# EAGLE design picoDotstar (EAGLE 9.6.2)
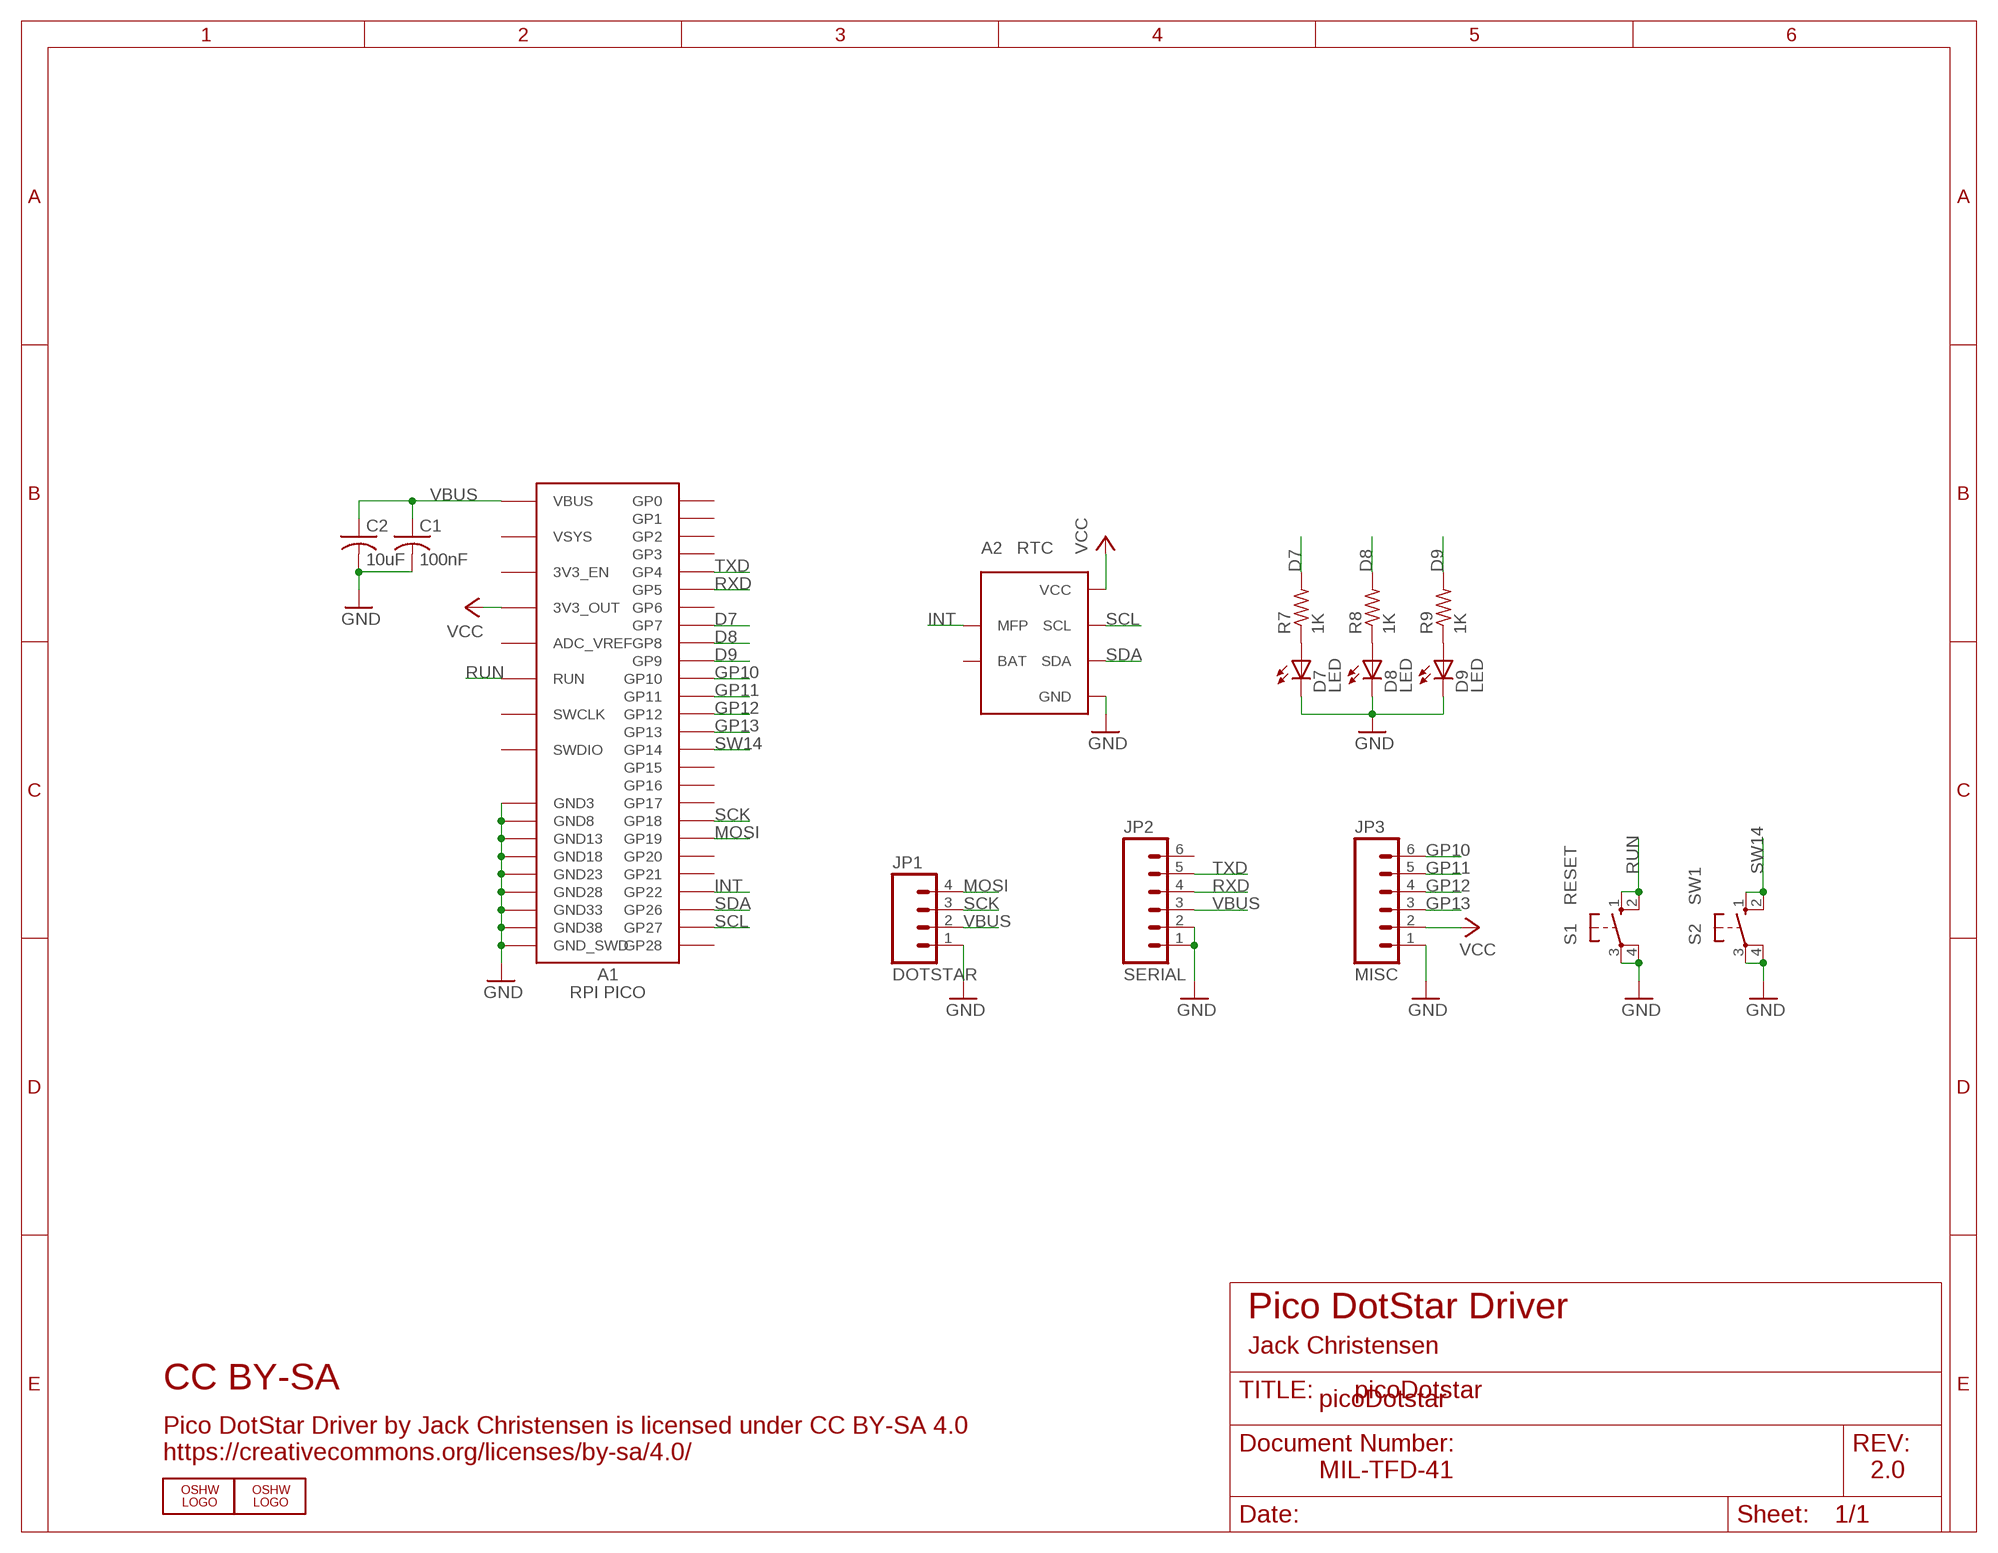
[diagram p0: schematic, sheet 1]

## Parts
A1  RPI PICO  PICOPICO  [PICO]
A2  RTC  RTC79412  [RTC79412]
C1  100nF  C-USM0805  [M0805]
C2  10uF  C-USM0805  [M0805]
D7  LED  LEDD0805  [D0805]
D8  LED  LEDD0805  [D0805]
D9  LED  LEDD0805  [D0805]
JP1  DOTSTAR  M04LOCK  [1X04_LOCK]
JP2  SERIAL  M06LOCK  [1X06_LOCK]
JP3  MISC  M06LOCK  [1X06_LOCK]
LOGO2  OSHW_LOGO_8MILX0100-NT  [OSHW_8X100_NOTEXT]
LOGO3  OSHW_LOGO_8MILX0150-NT  [OSHW_8X150_NOTEXT]
R7  1K  R-US_M0805  [M0805]
R8  1K  R-US_M0805  [M0805]
R9  1K  R-US_M0805  [M0805]
S1  RESET  10-XXOCT  [B3F-10XXOCT]
S2  SW1  10-XXOCT  [B3F-10XXOCT]

## Nets
D7: A1.P$10(GP7) R7.2
D8: A1.P$11(GP8) R8.2
D9: A1.P$12(GP9) R9.2
GND: A1.P$03(GND3) A1.P$08(GND8) A1.P$13(GND13) A1.P$18(GND18) A1.P$23(GND23) A1.P$28(GND28) A1.P$33(GND33) A1.P$38(GND38) A1.P$SWGND(GND_SWD) A2.8(GND) C1.2 C2.2 D7.K(C) D8.K(C) D9.K(C) JP1.1 JP2.1 JP2.2 JP3.1 S1.3(P) S1.4(P1) S2.3(P) S2.4(P1)
GP10: A1.P$14(GP10) JP3.6
GP11: A1.P$15(GP11) JP3.5
GP12: A1.P$16(GP12) JP3.4
GP13: A1.P$17(GP13) JP3.3
INT: A1.P$29(GP22) A2.3(MFP)
MOSI: A1.P$25(GP19) JP1.4
N$3: D7.A R7.1
N$4: D8.A R8.1
N$5: D9.A R9.1
RUN: A1.P$30(RUN) S1.1(S) S1.2(S1)
RXD: A1.P$07(GP5) JP2.4
SCK: A1.P$24(GP18) JP1.3
SCL: A1.P$32(GP27) A2.6(SCL)
SDA: A1.P$31(GP26) A2.5(SDA)
SW14: A1.P$19(GP14) S2.1(S) S2.2(S1)
TXD: A1.P$06(GP4) JP2.5
VBUS: A1.P$40(VBUS) C1.1 C2.1 JP1.2 JP2.3
VCC: A1.P$36(3V3_OUT) A2.7(VCC) JP3.2
Unconnected: A1.P$01(GP0) A1.P$02(GP1) A1.P$04(GP2) A1.P$05(GP3) A1.P$09(GP6) A1.P$20(GP15) A1.P$21(GP16) A1.P$22(GP17) A1.P$26(GP20) A1.P$27(GP21) A1.P$34(GP28) A1.P$35(ADC_VREF) A1.P$37(3V3_EN) A1.P$39(VSYS) A1.P$SWCLK(SWCLK) A1.P$SWDIO(SWDIO) A2.1(BAT) JP2.6

## Notes on the sheet
- Pico DotStar Driver
- Jack Christensen
- CC BY-SA
- picoDotstar
- Pico DotStar Driver by Jack Christensen is licensed under CC BY-SA 4.0
  https://creativecommons.org/licenses/by-sa/4.0/
- MIL-TFD-41 | 2.0

## Library data of the parts
A1 = _jc:PICO: Raspberry Pi Pico microcontroller.
A2 = _jc:RTC79412
C1 C2 = _jc:C-US: CAPACITOR, American symbol
D7-D9 = _jc:LED: LED OSRAM: - CHIPLED LG R971, LG N971, LY N971, LG Q971, LY Q971, LO R971, LY R971 LH N974, LH R974 LS Q976, LO Q976, LY Q976 LO Q996 - Hyper CHIPLED LW Q18S LB Q993, LB Q99A, LB R99A - SideLED LS A670, LO A670, LY A670, LG A670, LP A670 LB A673, LV A673, LT A673, LW A673 LH A674 LY A675 LS A676, LA A676, LO A676, LY A676, LW A676 LS A679, LY A679, LG A679 - Hyper Micro SIDELED® LS Y876, LA Y876, LO Y876, LY Y876 LT Y87S - SmartLED LW L88C, LW L88S LB L89C, LB L89S, LG L890 LS L89K, LO L89K, LY L89K LS L896, LA L896, LO L896, LY L896 - TOPLED LS T670, LO T670, LY T670, LG T670, LP T670 LSG T670, LSP T670, LSY T670, LOP T670, LYG T670 LG T671, LOG T671, LSG T671 LB T673, LV T673, LT T673, LW T673 LH T674 LS T676, LA T676, LO T676, LY T676, LB T676, LH T676, LSB T676, LW T676 LB T67C, LV T67C, LT T67C, LS T67K, LO T67K, LY T67K, LW E67C LS E67B, LA E67B, LO E67B, LY E67B, LB E67C, LV E67C, LT E67C LW T67C LS T679, LY T679, LG T679 LS T770, LO T770, LY T770, LG T770, LP T770 LB T773, LV T773, LT T773, LW T773 LH T774 LS E675, LA E675, LY E675, LS T675 LS T776, LA T776, LO T776, LY T776, LB T776 LHGB T686 LT T68C, LB T68C - Hyper Mini TOPLED® LB M676 - Mini TOPLED Santana® LG M470 LS M47K, LO M47K, LY M47K Source: http://www.osram.convergy.de/
JP1 = SparkFun:M04: Header 4 Standard 4-pin 0.1" header. Use with straight break away headers (SKU : PRT-00116), right angle break away headers (PRT-00553), swiss pins (PRT-00743), machine pins (PRT-00117), and female headers (PRT-00115). Molex polarized connector foot print use with SKU : PRT-08231 with associated crimp pins and housings.
JP2 JP3 = SparkFun:M06: Header 6 Standard 6-pin 0.1" header. Use with straight break away headers (SKU : PRT-00116), right angle break away headers (PRT-00553), swiss pins (PRT-00743), machine pins (PRT-00117), and female headers (PRT-00115). Molex polarized connector foot print use with SKU : PRT-08094 with associated crimp pins and housings. NOTES ON THE VARIANTS LOCK and LOCK_LONGPADS... This footprint was designed to help hold the alignment of a through-hole component (i.e. 6-pin header) while soldering it into place. You may notice that each hole has been shifted either up or down by 0.005 of an inch from it's more standard position (which is a perfectly straight line). This slight alteration caused the pins (the squares in the middle) to touch the edges of the holes. Because they are alternating, it causes a "brace" to hold the component in place. 0.005 has proven to be the perfect amount of "off-center" position when using our standard breakaway headers. Although looks a little odd when you look at the bare footprint, once you have a header in there, the alteration is very hard to notice. Also, if you push a header all the way into place, it is covered up entirely on the bottom side. This idea of altering the position of holes to aid alignment will be further integrated into the Sparkfun Library for other footprints. It can help hold any component with 3 or more connection pins.
LOGO2 LOGO3 = ohw-logo:OSHW_LOGO_8MIL
R7-R9 = _jc:R-US_: RESISTOR, American symbol
S1 S2 = _jc:10-XX: OMRON SWITCH

## Board
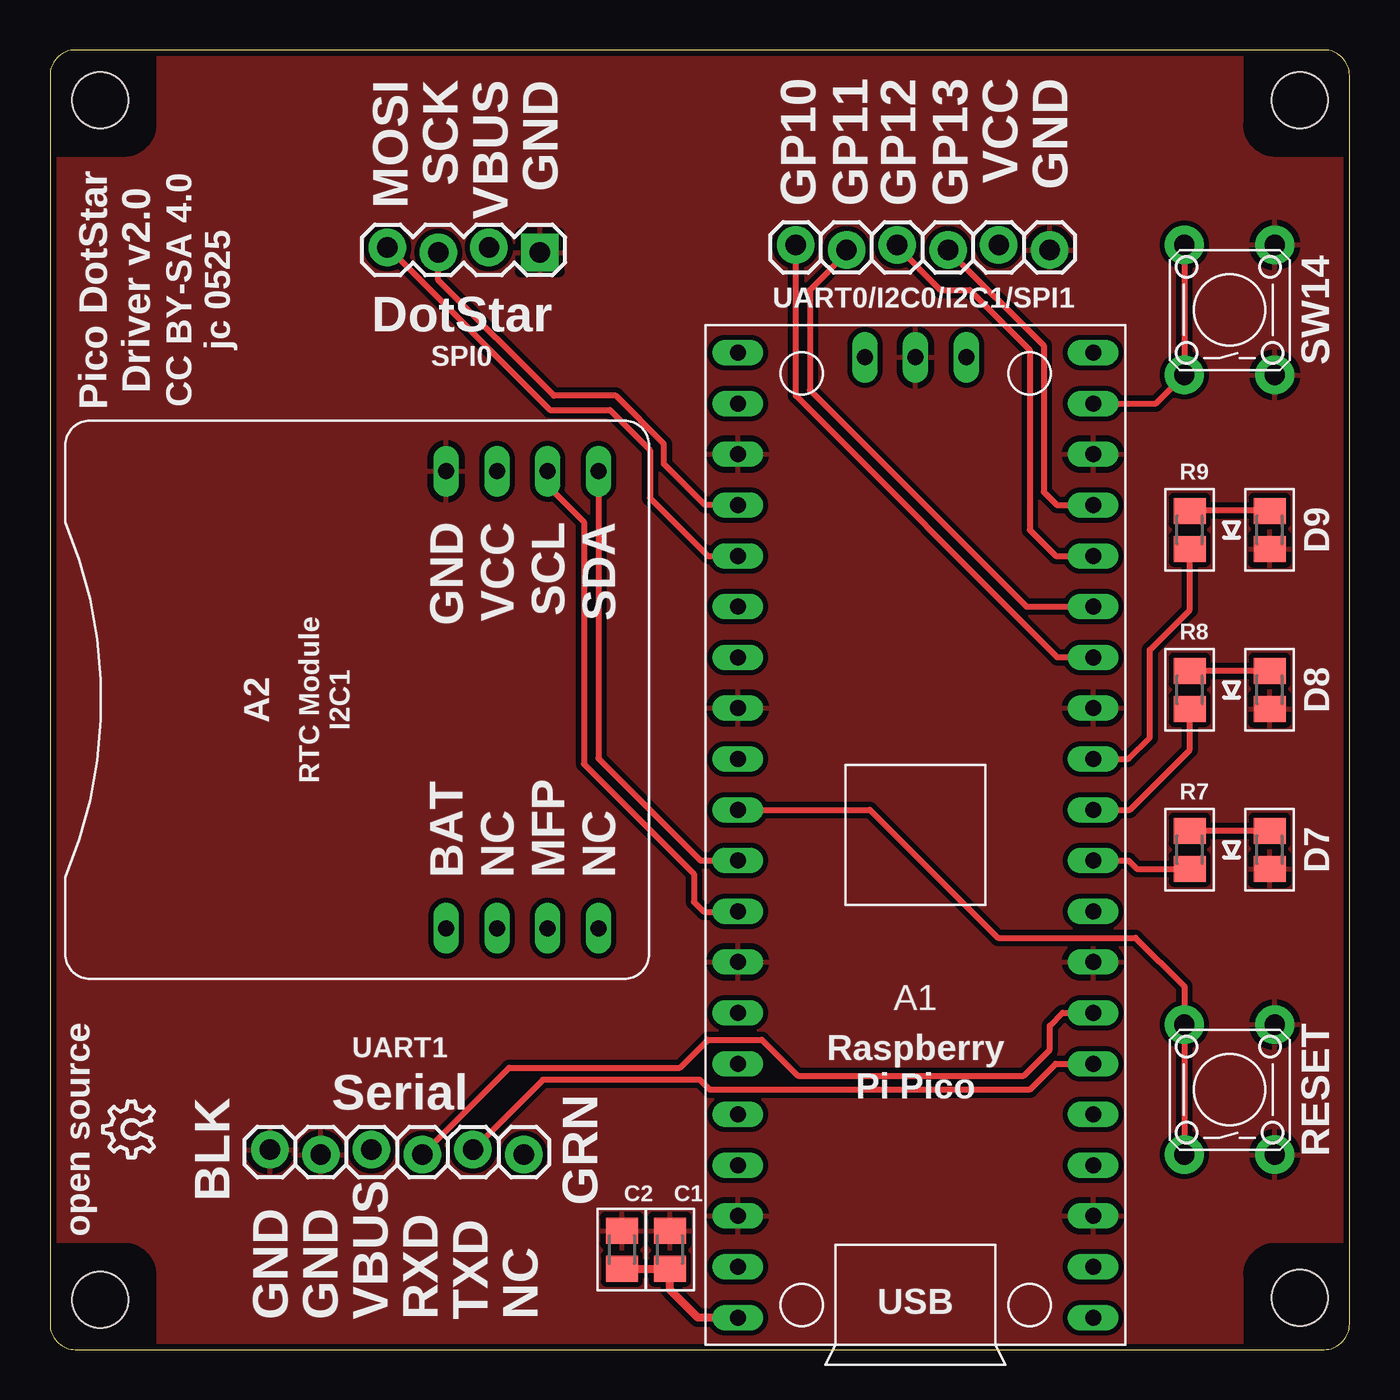
[diagram p1: board, top side]
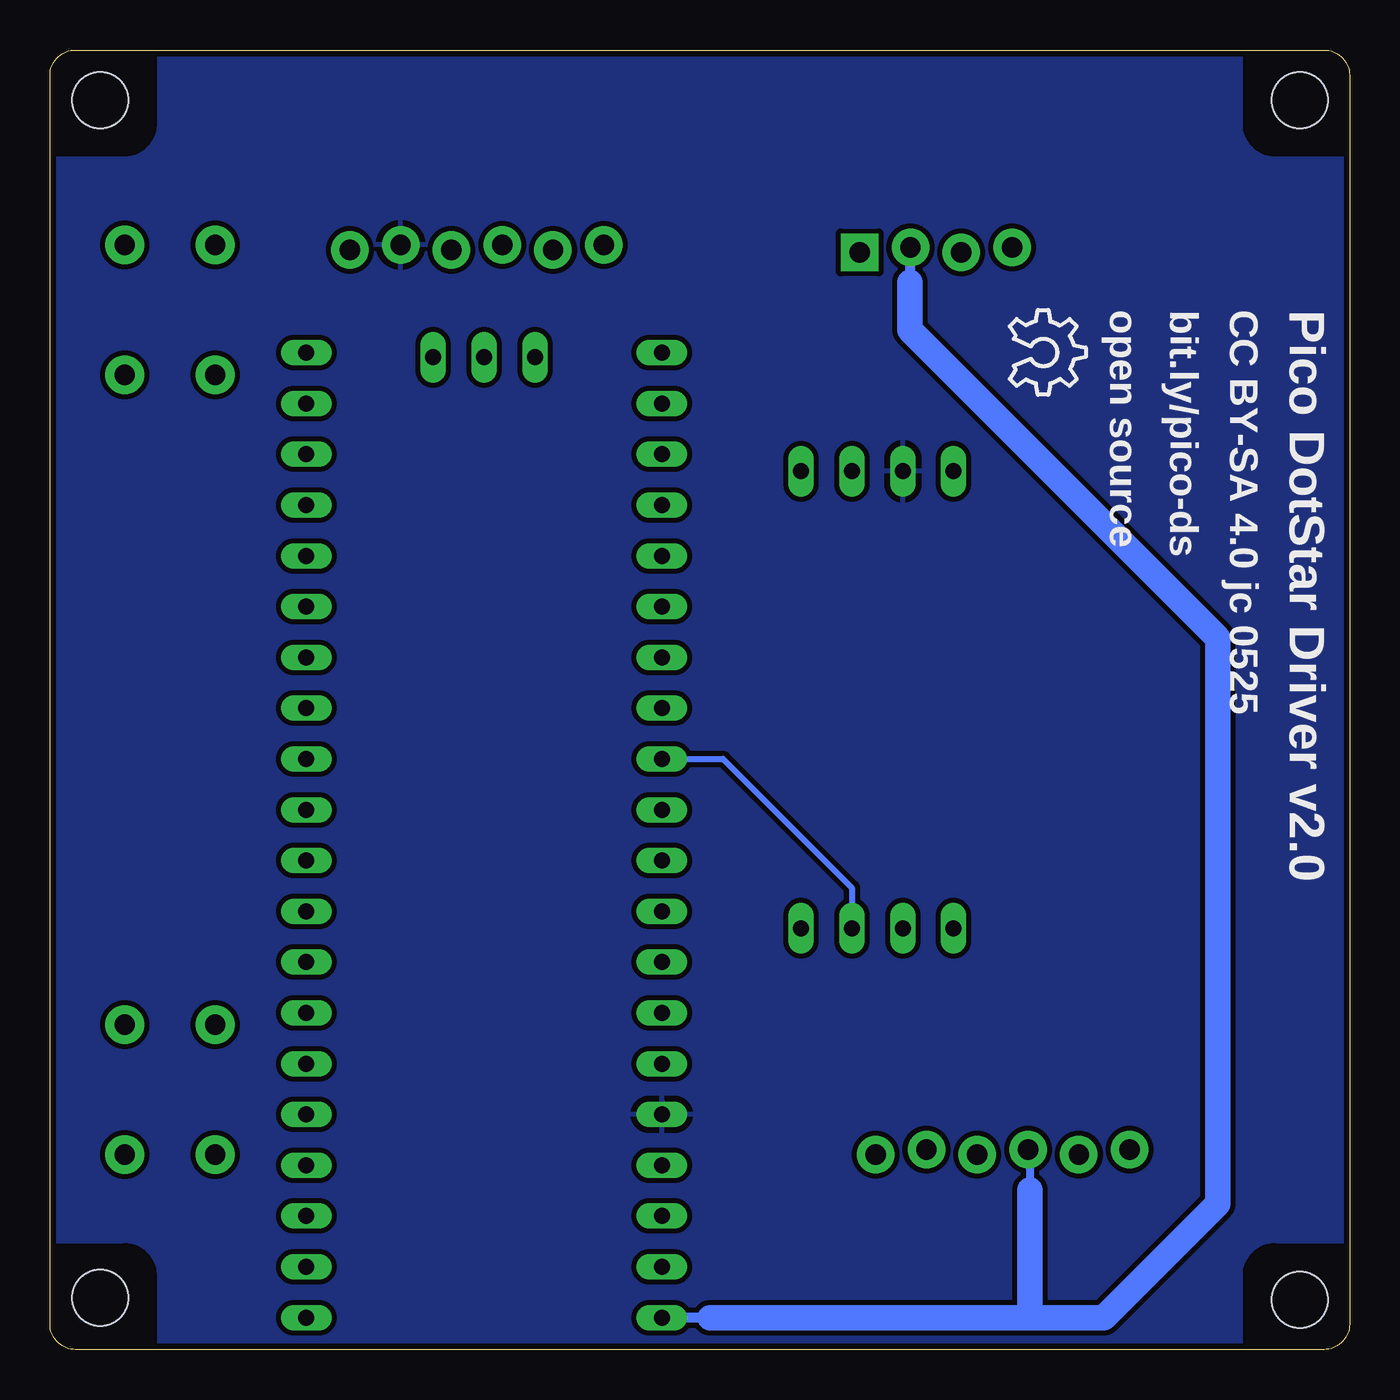
[diagram p2: board, bottom side, seen from below]

Size 65 x 65 mm. Coordinates in mm from the lower left corner, seen from the top.
Outline: 1.27,0 63.73,0 arc90 65,1.27 65,63.73 arc90 63.73,65 1.27,65 arc90 0,63.73 0,1.27 arc90 1.27,0
Copper layers (1*16): Top 0.0356mm / dielectric 1.5011mm / Bottom 0.0356mm
Design rules "oshpark-2layer-jc": minimum track width 8mil, minimum drill 13mil, track to track 8mil, track to pad 8mil, pad to pad 8mil, via to via 8mil, smd to smd 6mil, copper to edge 12mil, drill to drill 6mil, minimum pad ring 7mil, minimum via ring 7mil, stop-mask expansion 2.5mil, vias tented up to drill 20mil, thermal gap 12mil
Holes 2.8 mm at 2.5,2.5 62.5,2.6 62.5,62.5 2.5,62.5
tRestrict: area 0,0 to 5,5; area 60,0 to 65,5; area 60,60 to 65,65; area 0,60 to 5,65
bRestrict: area 0,0 to 5,5; area 60,0 to 65,5; area 60,60 to 65,65; area 0,60 to 5,65

### Footprints (pad centres in the part's own frame; a part is rotated, then mirrored left to right if it is on the bottom)
PICO = drill 0.8 pad 1.27 long: P$01 1.61,49.63; P$02 1.61,47.09; P$03 1.61,44.55; P$04 1.61,42.01; P$05 1.61,39.47; P$06 1.61,36.93; P$07 1.61,34.39; P$08 1.61,31.85; P$09 1.61,29.31; P$10 1.61,26.77; P$11 1.61,24.23; P$12 1.61,21.69; P$13 1.61,19.15; P$14 1.61,16.61; P$15 1.61,14.07; P$16 1.61,11.53; P$17 1.61,8.99; P$18 1.61,6.45; P$19 1.61,3.91; P$20 1.61,1.37; P$21 19.39,1.37; P$22 19.39,3.91; P$23 19.39,6.45; P$24 19.39,8.99; P$25 19.39,11.53; P$26 19.39,14.07; P$27 19.39,16.61; P$28 19.39,19.15; P$29 19.39,21.69; P$30 19.39,24.23; P$31 19.39,26.77; P$32 19.39,29.31; P$33 19.39,31.85; P$34 19.39,34.39; P$35 19.39,36.93; P$36 19.39,39.47; P$37 19.39,42.01; P$38 19.39,44.55; P$39 19.39,47.09; P$40 19.39,49.63; P$SWCLK 7.96,1.6; P$SWDIO 13.04,1.6; P$SWGND 10.5,1.6
RTC79412 = drill 0.8 pad 1.27 long: 1 -11.43,-3.81; 2 -11.43,-6.35; 3 -11.43,-8.89; 4 -11.43,-11.43; 5 11.43,-11.43; 6 11.43,-8.89; 7 11.43,-6.35; 8 11.43,-3.81
M0805 = smd 1.3 x 1.6: 1 -0.95,0; 2 0.95,0
D0805 = smd 1.3 x 1.6: A -0.95,0; K 0.95,0
1X04_LOCK = drill 1.016 pad 1.88 square: 1 0,0.127 | drill 1.016 pad 1.88: 2 2.54,-0.127; 3 5.08,0.127; 4 7.62,-0.127
1X06_LOCK = drill 1.016 pad 1.88: 1 0,0; 2 2.54,-0.254; 3 5.08,0; 4 7.62,-0.254; 5 10.16,0; 6 12.7,-0.254
B3F-10XXOCT = drill 1.016 pad 1.93: 1 -3.251,2.261; 2 3.251,2.261; 3 -3.251,-2.261; 4 3.251,-2.261

### Placement (x,y rotation side)
A1  53.79,51.23 180 top
A2  16,32.5 90 top
C1  31,5 90 top
C2  28.6,5 90 top
D7  61,25 270 top
D8  61,33 270 top
D9  61,41 270 top
JP1  24.5,55 180 top
JP2  11,10 0 top
JP3  50,55 180 top
LOGO2  5.2,9.6 90 top
LOGO3  17,52 270 bottom
R7  57,25 270 top
R8  57,33 270 top
R9  57,41 270 top
S1  59,13 90 top
S2  59,52 90 top

### Tracks (layer width: path | path; a pad name or v marks a point on that pad's centre or on a via)
D7
  Top 0.305: A1.P$10 53.94,24.46 54.35,24.05 R7.2
D8
  Top 0.305: A1.P$11 54,27 57,30 R8.2
D9
  Top 0.305: A1.P$12 53.94,29.54 55,30.6 55,35 57,37 R9.2
GND
  pour Top (isolate 0.254): -1,66 66,66 66,-1 -1,-1
GP10
  Top 0.305: A1.P$14 50.38,34.62 37.3,47.7 JP3.6
GP11
  Top 0.305: JP3.5 39.84,54.84 38,53 38,48 48.84,37.16 A1.P$15
GP12
  Top 0.305: JP3.4 42.38,55.15 44.53,53 46,53 49,50 49,41 50.3,39.7 A1.P$16
GP13
  Top 0.305: A1.P$17 50.36,42.24 49.7,42.9 49.7,50.22 JP3.3
INT
  Bottom 0.305: A1.P$29 31.34,29.54 24.89,23.09 A2.3
MOSI
  Top 0.305: A1.P$25 32.9,39.7 30,42.6 30,45 28,47 25.01,47 JP1.4
N$3
  Top 0.305: D7.A R7.1
N$4
  Top 0.305: D8.A R8.1
N$5
  Top 0.305: D9.A R9.1
RUN
  Top 0.305: A1.P$30 41,27 47.4,20.6 54.29,20.6 56.74,18.15 S1.2 S1.1
RXD
  Top 0.305: JP2.4 22.97,14.1 31.5,14.1 32.9,15.5 35.6,15.5 37.4,13.7 48.7,13.7 50,15 50,16.2 50.64,16.84 A1.P$07
SCK
  Top 0.305: A1.P$24 32.76,42.24 30.7,44.3 30.7,45.3 28.3,47.7 25.2,47.7 19.42,53.48 JP1.3
SCL
  Top 0.305: A2.6 24.89,43.21 26.7,41.4 26.7,29.3 32.2,23.8 32.2,22.4 32.7,21.9 34.38,21.9 A1.P$32
SDA
  Top 0.305: A2.5 27.43,29.57 32.54,24.46 A1.P$31
SW14
  Top 0.305: A1.P$19 55.31,47.32 S2.1 S2.2
TXD
  Top 0.305: A1.P$06 50.3,14.3 49,13 33,13 32.5,13.5 24.66,13.5 JP2.5
VBUS
  Top 0.406: C2.1 C1.1 31,3 32.4,1.6 A1.P$40
  Bottom 0.406: 16.08,1.68 16,1.6 | JP2.3 16,9.92 16,8
  Bottom 0.508: 32,1.6 A1.P$40 | JP1.2 22,55.09 22,53.4
  Bottom 1.27: 32,1.6 16,1.6 14.1,1.6 12.3,1.6 6.6,7.3 6.6,35.6 22,51 22,53.4 | 16,8 16,1.76 16.08,1.68
VCC
  pour Bottom (isolate 0.254): -2.5,67.5 67.5,67.5 67.5,-2 -2.5,-2

### Text on the board
tPlace: MOSI | SCK | VBUS | GND | GP10 | GP11 | GP12 | GP13 | VCC | GND | Pico DotStar / Driver v2.0 | CC BY-SA 4.0 / jc 0525 | DotStar | UART0/I2C0/I2C1/SPI1 | SW14 | SPI0 | RTC Module / I2C1 | UART1 | RESET | Serial | open source | BLK | GRN | GND | GND | VBUS | RXD | TXD | NC
bPlace: Pico DotStar Driver v2.0 | CC BY-SA 4.0 jc 0525 | bit.ly/pico-ds | open source